# Altium schematic sheet FlescherTow.SchDoc
size A4
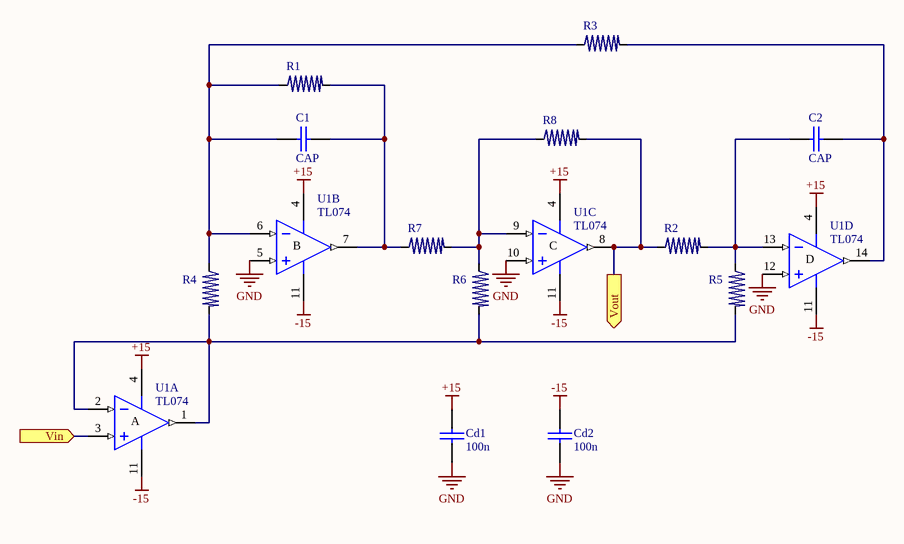
[diagram p0: FlescherTow.SchDoc]

## Parts
C1  CAP  [0805]
C2  CAP  [0805]
Cd1  100n  [0805]
Cd2  100n  [0805]
R1  (no value)  [PCBComponent_1]
R2  (no value)  [PCBComponent_1]
R3  (no value)  [PCBComponent_1]
R4  (no value)  [PCBComponent_1]
R5  (no value)  [PCBComponent_1]
R6  (no value)  [PCBComponent_1]
R7  (no value)  [PCBComponent_1]
R8  (no value)  [PCBComponent_1]
U1  TL074  [J014]  (parts A,B,C,D of 4)

## Ports
Vin (in), Vout (out)

## Nets
+15: Cd1.1 U1.4(V+)
-15: Cd2.1 U1.11(V-)
GND: Cd1.2 Cd2.2 U1.5(IN+) U1.10(IN+) U1.12(IN+)
Vin: U1.3(IN+) ; port Vin
Vout: R2.2 R8.1 U1.8(OUT) ; port Vout
NetC1_1: C1.1 R1.2 R3.2 R4.2 U1.6(IN-)
NetC1_2: C1.2 R1.1 R7.2 U1.7(OUT)
NetC2_1: C2.1 R2.1 R5.2 U1.13(IN-)
NetC2_2: C2.2 R3.1 U1.14(OUT)
NetR4_1: R4.1 R5.1 R6.1 U1.1(OUT) U1.2(IN-)
NetR6_2: R6.2 R7.1 R8.2 U1.9(IN-)

## Notes on the sheet
- (in symbol TL074J, part A) A
- (in symbol TL074J, part B) B
- (in symbol TL074J, part C) C
- (in symbol TL074J, part D) D

## Library data of the parts
Cd1 Cd2 = CAP
R1-R8 = SPres
U1 = TL074J: Low-Noise JFET-Input Operational Amplifier; Published: 16-Jan-2001; LatestRevisionDate: 04-Mar-2005; LatestRevisionNote: Stylized 3D Model Added.; DatasheetVersion: Aug-1996; PackageVersion: Jun-1999; PackageReference: J014; Publisher: Altium Limited; PackageDescription: DIP; 14 Leads; Row Spacing 7.62 mm; Pitch 2.54 mm; ComponentLink1Description: Manufacturer Link; ComponentLink1URL: http://www.ti.com/; ComponentLink2Description: Datasheet; ComponentLink2URL: http://www-s.ti.com/sc/ds/tl074.pdf